# EAGLE design chariot_comms_a (EAGLE 9.3.0)
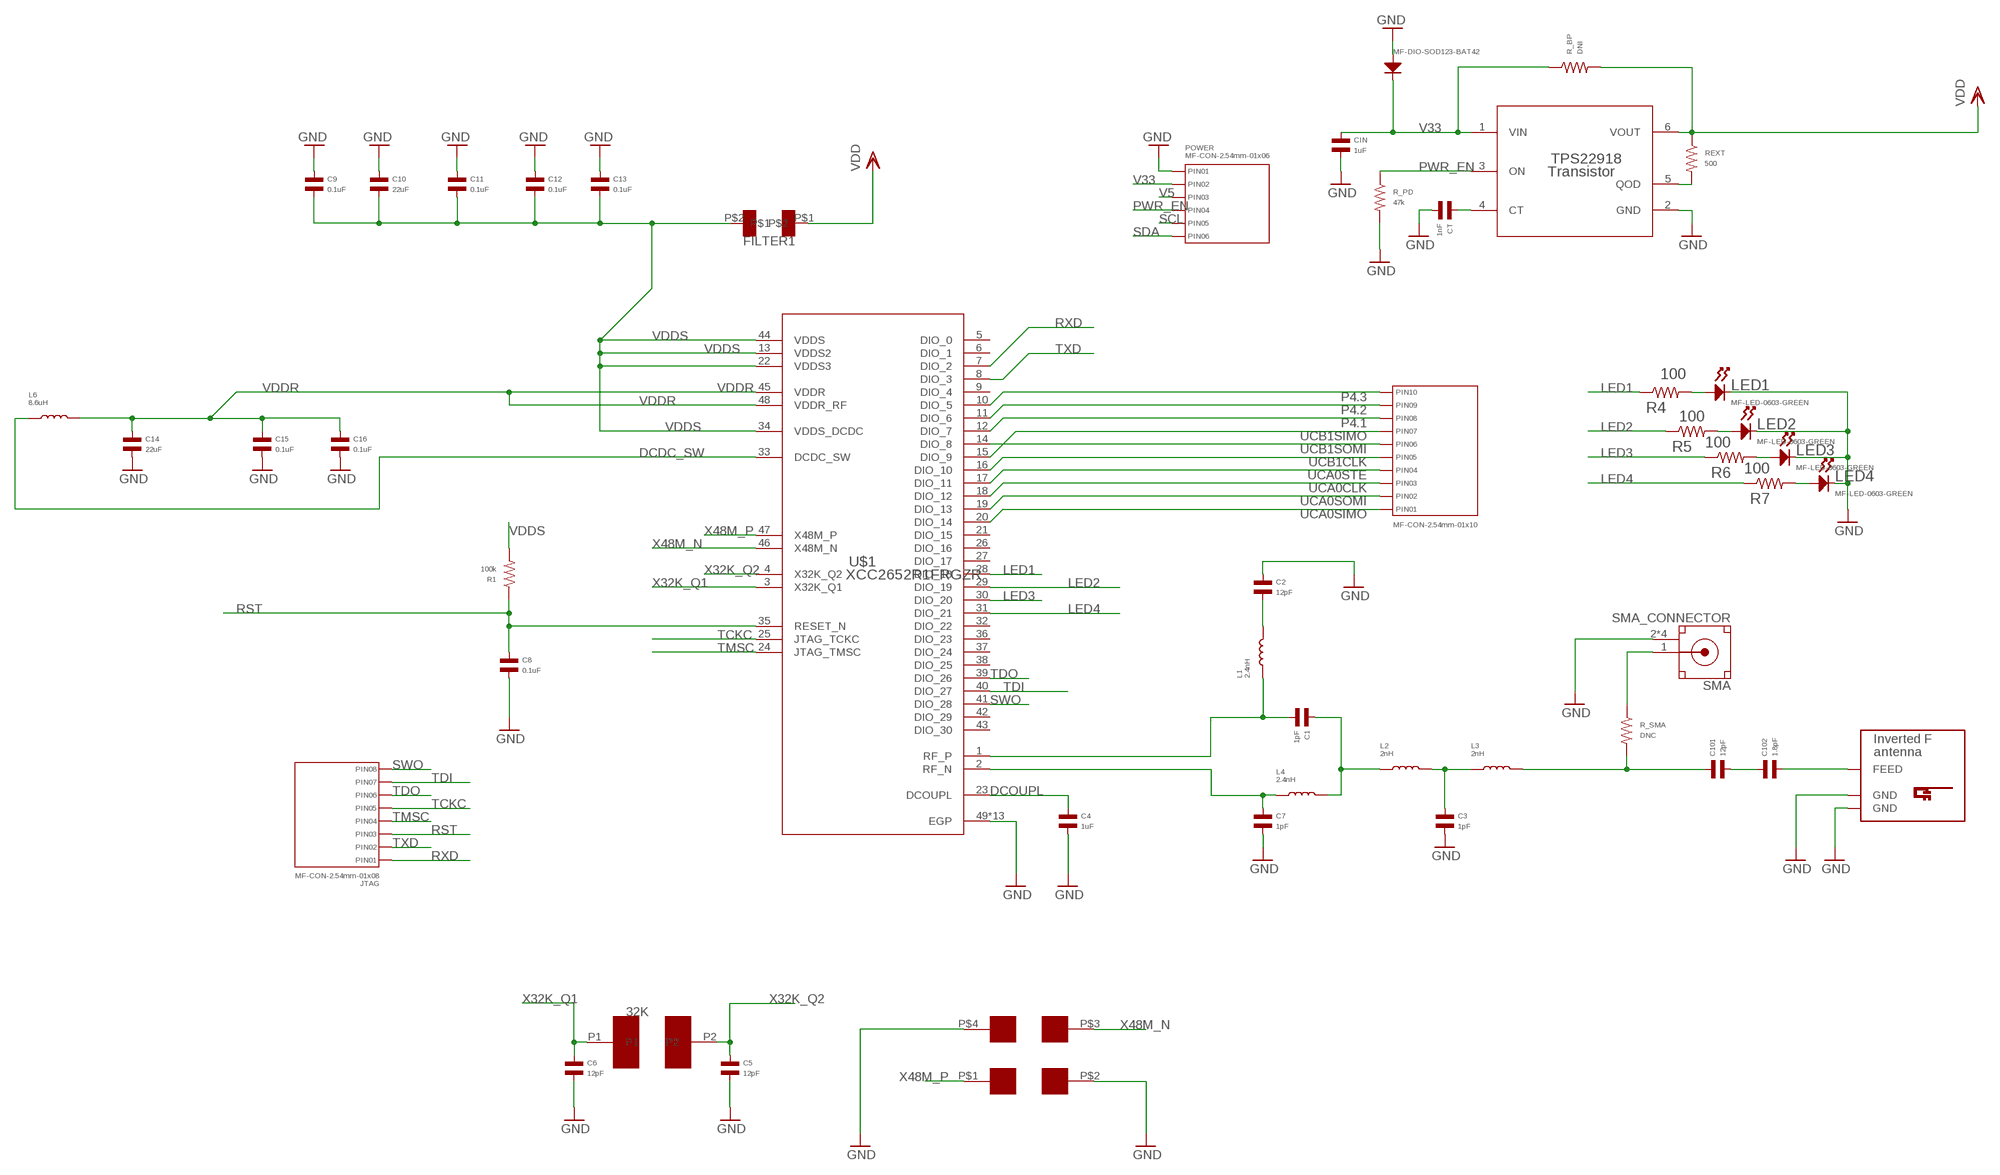
[diagram p0: schematic, sheet 1]

## Parts
32K  FC-135  [FC-135]
48M  NX2016SA-48M-EXS00A-CS05517  [NX2016SA-48M-EXS00A-CS05517]
C1  1pF  CAPACITOR_NP_0603  [C0603]
C2  12pF  CAPACITOR_NP_0603  [C0603]
C3  1pF  CAPACITOR_NP_0603  [C0603]
C4  1uF  CAPACITOR_NP_0603  [C0603]
C5  12pF  CAPACITOR_NP_0603  [C0603]
C6  12pF  CAPACITOR_NP_0603  [C0603]
C7  1pF  CAPACITOR_NP_0603  [C0603]
C8  0.1uF  CAPACITOR_NP_0603  [C0603]
C9  0.1uF  CAPACITOR_NP_0603  [C0603]
C10  22uF  CAPACITOR_NP_0603  [C0603]
C11  0.1uF  CAPACITOR_NP_0603  [C0603]
C12  0.1uF  CAPACITOR_NP_0603  [C0603]
C13  0.1uF  CAPACITOR_NP_0603  [C0603]
C14  22uF  CAPACITOR_NP_0603  [C0603]
C15  0.1uF  CAPACITOR_NP_0603  [C0603]
C16  0.1uF  CAPACITOR_NP_0603  [C0603]
C101  12pF  CAPACITOR_NP_0603  [C0603]
C102  1.8pF  CAPACITOR_NP_0603  [C0603]
CIN  1uF  CAPACITOR_NP_0603  [C0603]
COMMS_J  MF-CON-2.54mm-01x10  CON_01X10_PTH_2.54MM  [PTH_2.54MM_01X10]
CT  1nF  CAPACITOR_NP_0603  [C0603]
D1  MF-DIO-SOD123-BAT42  DIODES_BAT42_SOD-123  [SOD-123]
FILTER1  BLM18HE152SN1D  [BLM18HE152SN1D]
JTAG  MF-CON-2.54mm-01x08  CON_01X08_PTH_2.54MM  [PTH_2.54MM_01X08]
L1  2.4nH  INDUCTOR_0603  [L0603]
L2  2nH  INDUCTOR_0603  [L0603]
L3  2nH  INDUCTOR_0603  [L0603]
L4  2.4nH  INDUCTOR_0603  [L0603]
L6  8.6uH  INDUCTOR_0603  [L0603]
LED1  MF-LED-0603-GREEN  LED_SINGLE-0603-GREEN  [LED0603]
LED2  MF-LED-0603-GREEN  LED_SINGLE-0603-GREEN  [LED0603]
LED3  MF-LED-0603-GREEN  LED_SINGLE-0603-GREEN  [LED0603]
LED4  MF-LED-0603-GREEN  LED_SINGLE-0603-GREEN  [LED0603]
POWER  MF-CON-2.54mm-01x06  CON_01X06_PTH_2.54MM  [PTH_2.54MM_01X06]
R1  100k  RESISTOR_0603  [R0603]
R4  100  RESISTOR_0603  [R0603]
R5  100  RESISTOR_0603  [R0603]
R6  100  RESISTOR_0603  [R0603]
R7  100  RESISTOR_0603  [R0603]
R_BP  DNI  RESISTOR_0603  [R0603]
R_PD  47k  RESISTOR_0603  [R0603]
R_SMA  DNC  RESISTOR_0603  [R0603]
REXT  500  RESISTOR_0603  [R0603]
SMA  SMA_CONNECTOR  [LPRS_SMA_CONNECTOR]
TPS22918  Transistor  TPS22918TDBVRQ1  [DBV0006A_N]
U$1  XCC2652R1FRGZR  [RGZ0048A]
U$2  INVERTED_F_ANTENNA+5  [DN007+5]

## Nets
DCDC_SW: L6.P$1 U$1.33(DCDC_SW)
DCOUPL: C4.P$1 U$1.23(DCOUPL)
GND: 48M.P$2 48M.P$4 C2.P$1 C3.P$2 C4.P$2 C5.P$2 C6.P$2 C7.P$2 C8.P$2 C9.P$1 C10.P$1 C11.P$1 C12.P$1 C13.P$1 C14.P$2 C15.P$2 C16.P$2 CIN.P$2 CT.P$2 D1.ANODE LED1.CATHODE LED2.CATHODE LED3.CATHODE LED4.CATHODE POWER.P$1(PIN1) R_PD.P$2 SMA.2(GND) SMA.3(GND) SMA.4(GND) SMA.5(GND) TPS22918.2(GND) U$1.49(EGP) U$1.V1(EGP) U$1.V2(EGP) U$1.V3(EGP) U$1.V4(EGP) U$1.V5(EGP) U$1.V6(EGP) U$1.V7(EGP) U$1.V8(EGP) U$1.V9(EGP) U$1.V10(EGP) U$1.V11(EGP) U$1.V12(EGP) U$2.GND U$2.GND@1(GND)
LED1: R4.P$1 U$1.28(DIO_18)
LED2: R5.P$1 U$1.29(DIO_19)
LED3: R6.P$1 U$1.30(DIO_20)
LED4: R7.P$1 U$1.31(DIO_21)
N$1: C102.P$2 U$2.FEED
N$2: LED1.ANODE R4.P$2
N$3: C2.P$2 L1.P$2
N$4: C1.P$1 L2.P$1 L4.P$2
N$5: C3.P$1 L2.P$2 L3.P$1
N$6: C101.P$1 L3.P$2 R_SMA.P$2
N$7: C101.P$2 C102.P$1
N$8: LED2.ANODE R5.P$2
N$9: REXT.P$2 TPS22918.5(QOD)
N$10: CT.P$1 TPS22918.4(CT)
N$11: LED3.ANODE R6.P$2
N$12: LED4.ANODE R7.P$2
N$15: R_SMA.P$1 SMA.1(SIG)
P4.1: COMMS_J.P$8(PIN8) U$1.12(DIO_7)
P4.2: COMMS_J.P$9(PIN9) U$1.11(DIO_6)
P4.3: COMMS_J.P$10(PIN10) U$1.10(DIO_5)
PWR_EN: POWER.P$4(PIN4) R_PD.P$1 TPS22918.3(ON)
RF_N: C7.P$1 L4.P$1 U$1.2(RF_N)
RF_P: C1.P$2 L1.P$1 U$1.1(RF_P)
RST: C8.P$1 JTAG.P$3(PIN3) R1.P$1 U$1.35(RESET_N)
RXD: JTAG.P$1(PIN1) U$1.7(DIO_2)
SCL: POWER.P$5(PIN5)
SDA: POWER.P$6(PIN6)
SWO: JTAG.P$8(PIN8) U$1.41(DIO_28)
TCKC: JTAG.P$5(PIN5) U$1.25(JTAG_TCKC)
TDI: JTAG.P$7(PIN7) U$1.40(DIO_27)
TDO: JTAG.P$6(PIN6) U$1.39(DIO_26)
TMSC: JTAG.P$4(PIN4) U$1.24(JTAG_TMSC)
TXD: JTAG.P$2(PIN2) U$1.8(DIO_3)
UCA0CLK: COMMS_J.P$3(PIN3) U$1.18(DIO_12)
UCA0SIMO: COMMS_J.P$1(PIN1) U$1.20(DIO_14)
UCA0SOMI: COMMS_J.P$2(PIN2) U$1.19(DIO_13)
UCA0STE: COMMS_J.P$4(PIN4) U$1.17(DIO_11)
UCB1CLK: COMMS_J.P$5(PIN5) U$1.16(DIO_10)
UCB1SIMO: COMMS_J.P$7(PIN7) U$1.15(DIO_9)
UCB1SOMI: COMMS_J.P$6(PIN6) U$1.14(DIO_8)
V5: POWER.P$3(PIN3)
V33: CIN.P$1 D1.CATHODE POWER.P$2(PIN2) R_BP.P$1 TPS22918.1(VIN)
VDD: FILTER1.P$1 R_BP.P$2 REXT.P$1 TPS22918.6(VOUT)
VDDR: C14.P$1 C15.P$1 C16.P$1 L6.P$2 U$1.45(VDDR) U$1.48(VDDR_RF)
VDDS: C9.P$2 C10.P$2 C11.P$2 C12.P$2 C13.P$2 FILTER1.P$2 R1.P$2 U$1.13(VDDS2) U$1.22(VDDS3) U$1.34(VDDS_DCDC) U$1.44(VDDS)
X32K_Q1: 32K.P1 C6.P$1 U$1.3(X32K_Q1)
X32K_Q2: 32K.P2 C5.P$1 U$1.4(X32K_Q2)
X48M_N: 48M.P$3 U$1.46(X48M_N)
X48M_P: 48M.P$1 U$1.47(X48M_P)
Unconnected: U$1.5(DIO_0) U$1.6(DIO_1) U$1.9(DIO_4) U$1.21(DIO_15) U$1.26(DIO_16) U$1.27(DIO_17) U$1.32(DIO_22) U$1.36(DIO_23) U$1.37(DIO_24) U$1.38(DIO_25) U$1.42(DIO_29) U$1.43(DIO_30)

## Library data of the parts
32K = CharIoT:FC-135: 32 kHz Crystal Oscilator
48M = CharIoT:NX2016SA-48M-EXS00A-CS05517: 24 MHz Crystal Oscilator NX2016SA-48M-EXS00A-CS05517
C1-C16 C101 C102 CIN CT = MF_Passives:CAPACITOR_NP: Library: MF_Passives Description: Device for Non-Polarized Capacitors. Manufacture part number (MPN) can be added via Attributes. Check https://factory.macrofab.com/parts for the house parts list.; POPULATE: 1
COMMS_J = MF_Connectors:CON_01X10: Library: MF_Connectors Description: Header Connector with 10 Positions and 01 Rows. Use the LABEL Attribute to label the pin on the schematic and PCB. You can remove the attributes on the PCB by using the SMASH function on the part and then deleting the text.; HOUSEPART: YES; MPN: MF-CON-2.54mm-01x10; POPULATE: 1; URL: https://factory.macrofab.com/part/MF-CON-2.54mm-01x10
D1 = MF_Discrete_Semiconductor:DIODES: Library: MF_Discrete_Semiconductor Description: Device for Single Packaged Diodes.; HOUSEPART: YES; MPN: MF-DIO-SOD123-BAT42; POPULATE: 1; URL: https://factory.macrofab.com/part/MF-DIO-SOD123-BAT42
FILTER1 = CharIoT:BLM18HE152SN1D
JTAG = MF_Connectors:CON_01X08: Library: MF_Connectors Description: Header Connector with 8 Positions and 01 Rows. Use the LABEL Attribute to label the pin on the schematic and PCB. You can remove the attributes on the PCB by using the SMASH function on the part and then deleting the text.; HOUSEPART: YES; MPN: MF-CON-2.54mm-01x08; POPULATE: 1; URL: https://factory.macrofab.com/part/MF-CON-2.54mm-01x08
L1-L4 L6 = MF_Passives:INDUCTOR: Library: MF_Passives Description: Device for Inductors. Manufacture part number (MPN) can be added via Attributes. Check https://factory.macrofab.com/parts for the house parts list.; POPULATE: 1
LED1-LED4 = MF_LEDs:LED_SINGLE: Library: MF_LEDs Description: Device for Single LED Packages. Manufacture part number (MFG#) can be added via Attributes.; HOUSEPART: YES; MPN: MF-LED-0603-GREEN; POPULATE: 1; URL: https://factory.macrofab.com/part/MF-LED-0603-GREEN
POWER = MF_Connectors:CON_01X06: Library: MF_Connectors Description: Header Connector with 6 Positions and 01 Rows. Use the LABEL Attribute to label the pin on the schematic and PCB. You can remove the attributes on the PCB by using the SMASH function on the part and then deleting the text.; HOUSEPART: YES; MPN: MF-CON-2.54mm-01x06; POPULATE: 1; URL: https://factory.macrofab.com/part/MF-CON-2.54mm-01x06
R1 R4-R7 R_BP R_PD R_SMA REXT = MF_Passives:RESISTOR: Library: MF_Passives Description: Device for Resistors. Manufacture part number (MPN), Voltage, Tolerance, and Wattage Rating can be added via Attributes. Check https://factory.macrofab.com/parts for the house parts list.; POPULATE: 1
SMA = SMA_CONNECTOR:SMA_CONNECTOR: CONNECTOR, SMA, ANTENNA; SVHC: No SVHC (19-Dec-2012); For Use With: Antenna; Kit Contents: SMA Connecto; AVAILABILITY: Unavailable; DESCRIPTION: CONNECTOR, SMA, ANTENNA; SVHC: No SVHC _19-Dec-2012_; For Use With: Antenna; Kit Contents: SMA Connector; MF: LPRS; MP: SMA CONNECTOR; PACKAGE: None; PRICE: None
TPS22918 = CharIoT:TPS22918TDBVRQ1; MANUFACTURER: Texas Instruments; PARTNUMBER: TPS22918TDBVRQ1; REFDES: RefDes; TYPE: TYPE; VALUE: Value
U$1 = CharIoT:XCC2652R1FRGZR: Comms Chip
U$2 = antenna:INVERTED_F_ANTENNA: 2.4GHz Inverted F Antenna Based on TI Design Note DN007

## Board
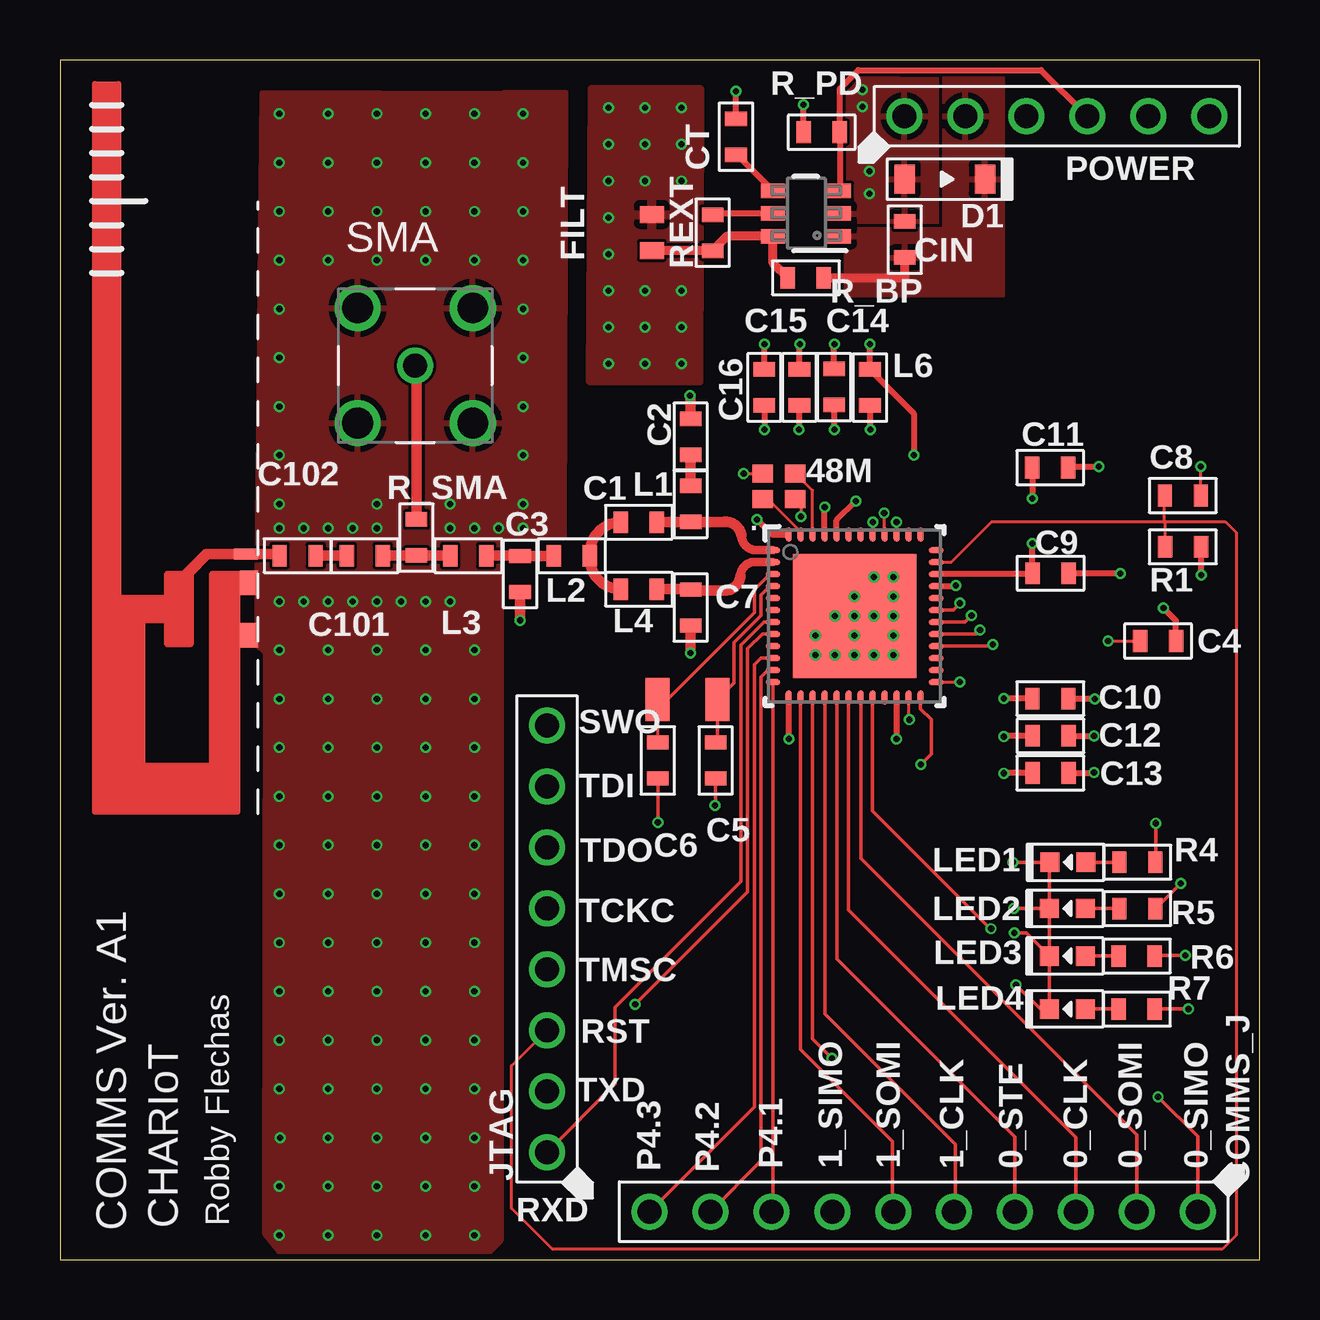
[diagram p1: board, top side]
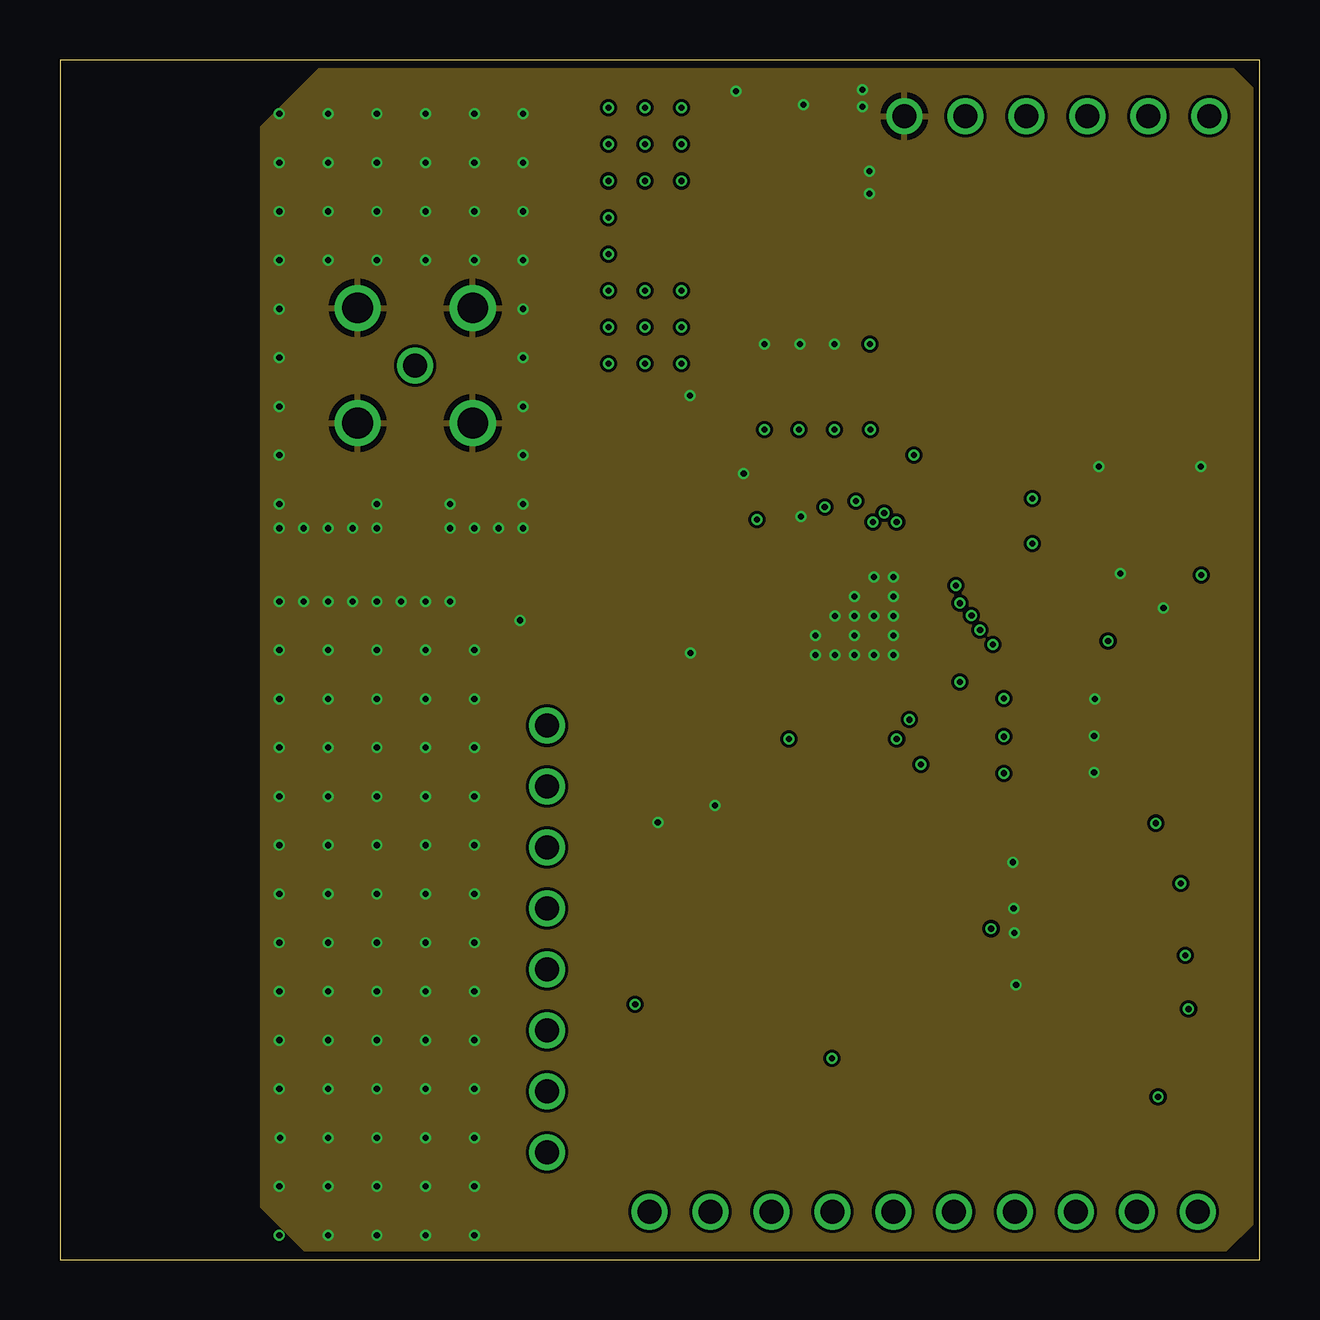
[diagram p2: board, inner layer Route2]
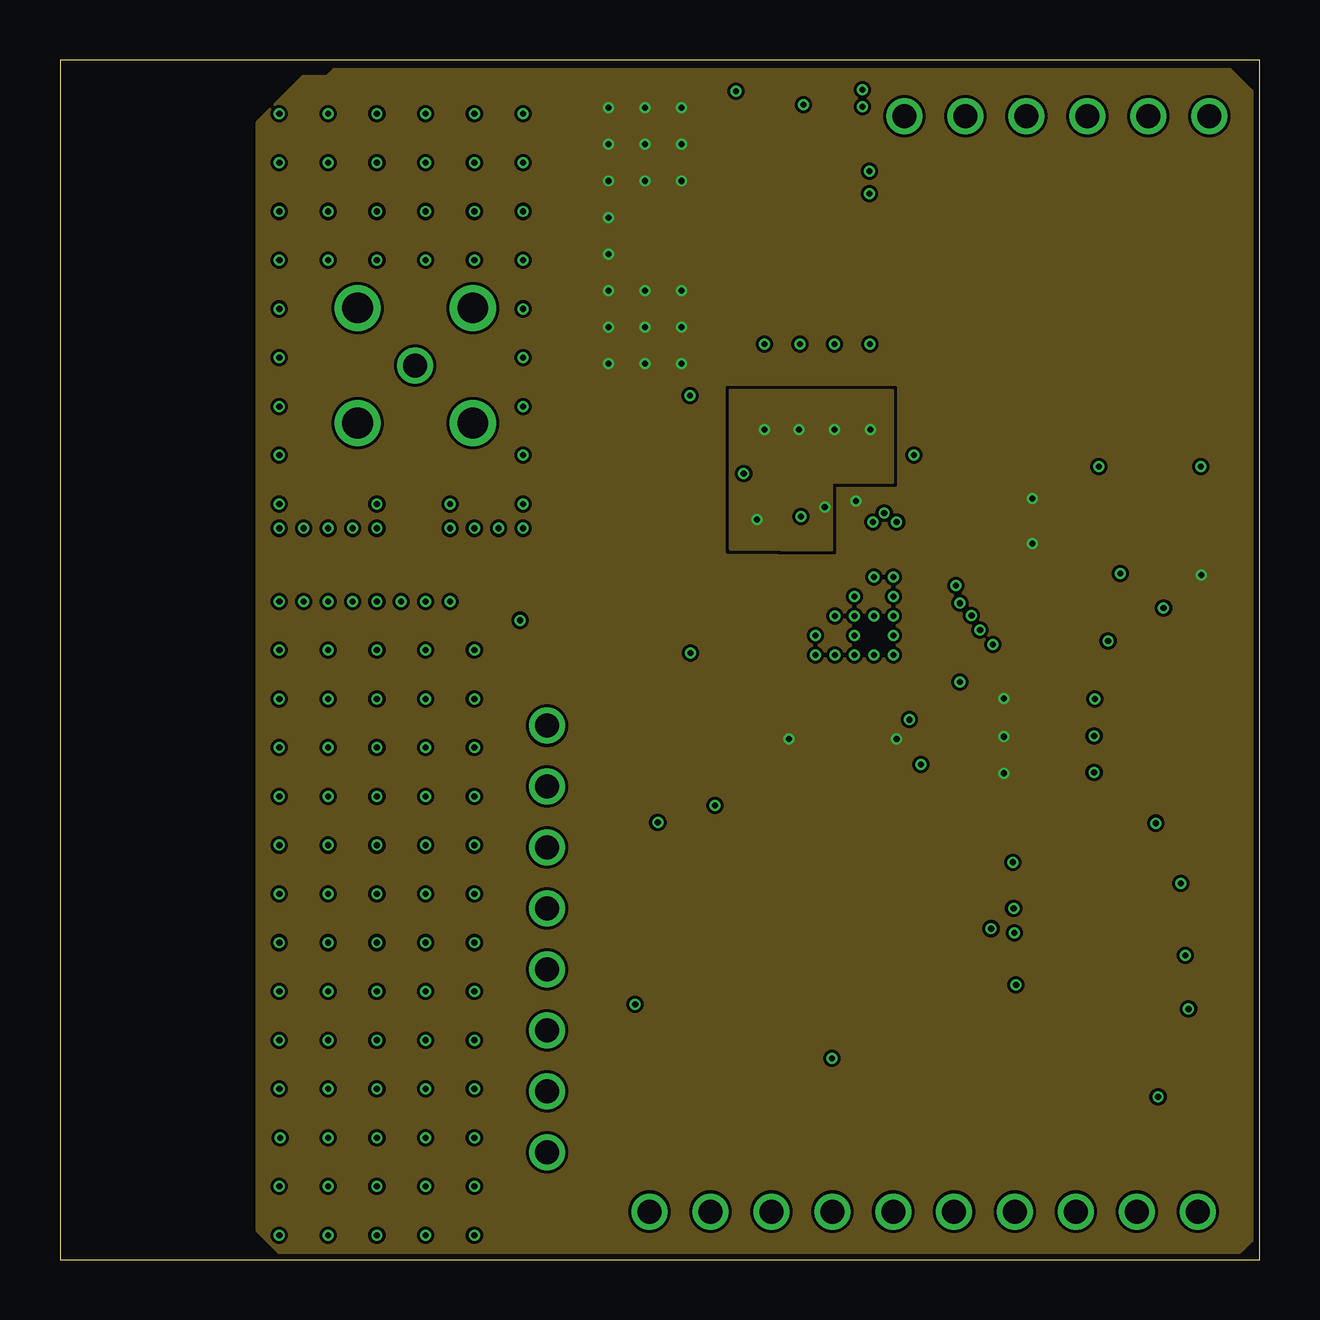
[diagram p3: board, inner layer Route15]
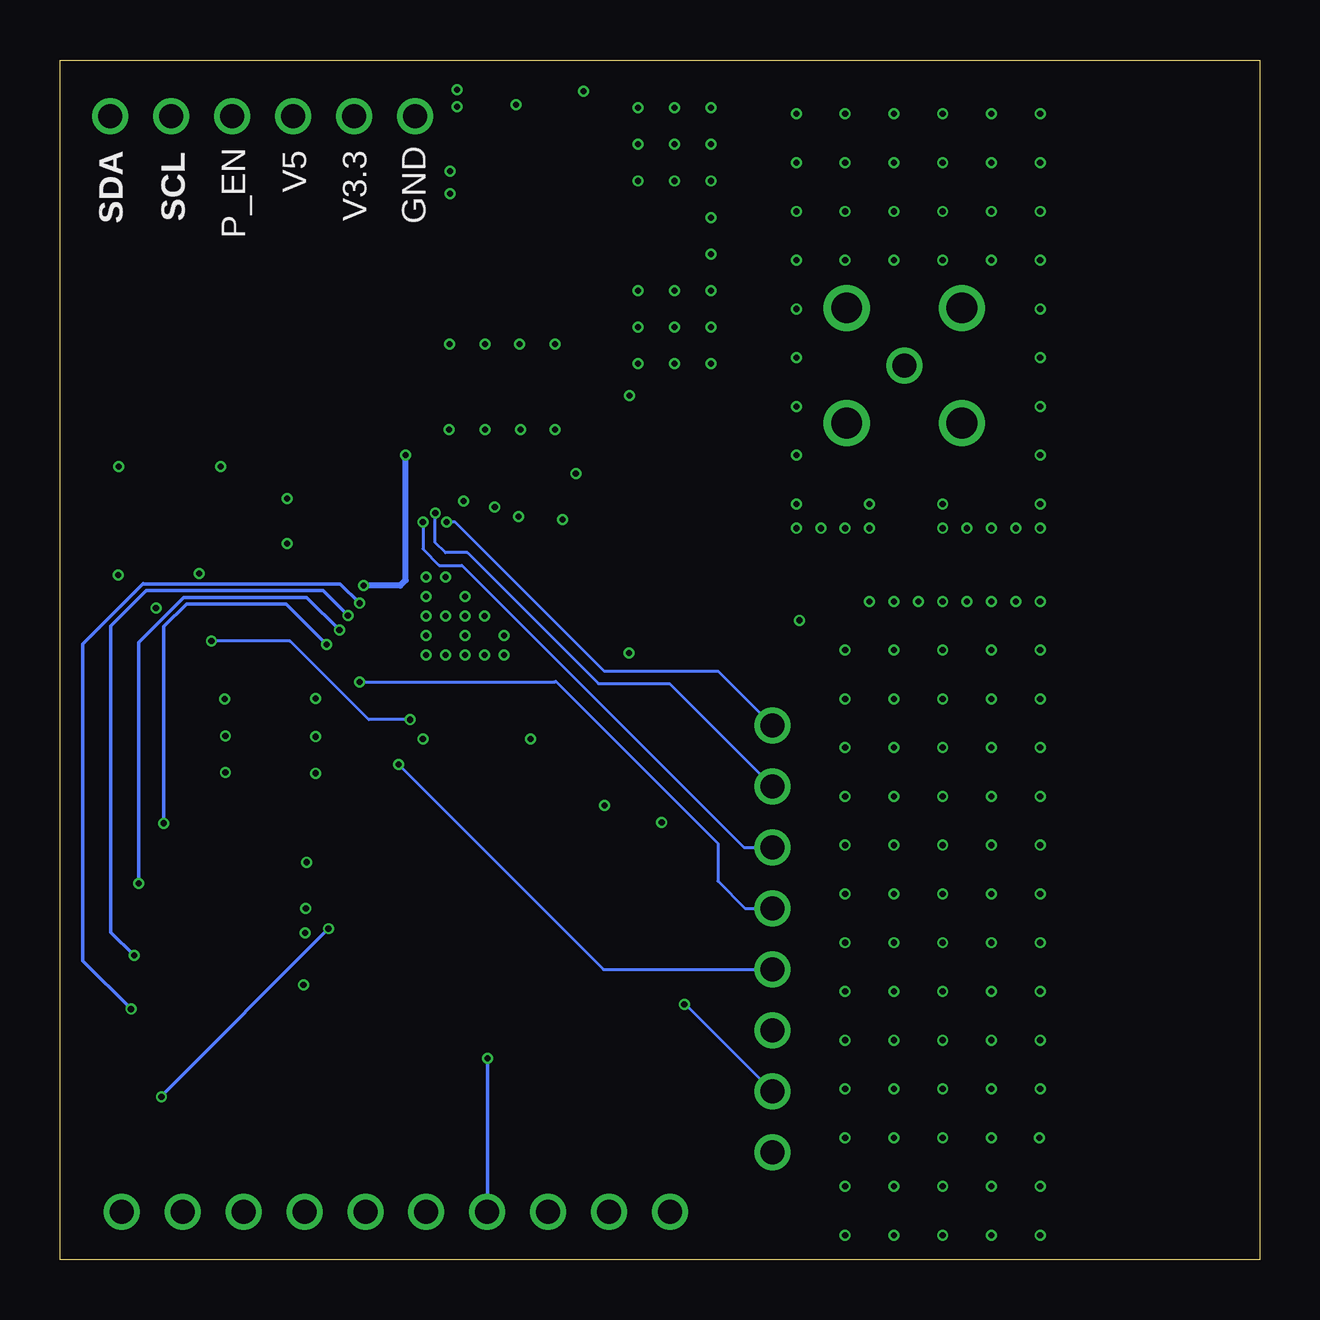
[diagram p4: board, bottom side, seen from below]

Size 50 x 50 mm. Coordinates in mm from the lower left corner, seen from the top.
Outline: 0,0 50,0 50,50 0,50 0,0
Copper layers (1*2*15*16): Top 0.035mm / dielectric 0.23mm / Route2 0.035mm / dielectric 0.93mm / Route15 0.035mm / dielectric 0.23mm / Bottom 0.035mm
Design rules "MF_Standard_4_Layer *": minimum track width 5mil, minimum drill 10mil, track to track 5mil, track to pad 5mil, pad to pad 5mil, via to via 5mil, smd to smd 0mil, copper to edge 10mil, drill to drill 10mil, minimum pad ring 4mil, minimum via ring 4mil, stop-mask expansion 2mil, vias tented up to drill 25mil, thermal gap 10mil

### Footprints (pad centres in the part's own frame; a part is rotated, then mirrored left to right if it is on the bottom)
FC-135 = smd 1 x 1.8: P1 -1.25,0; P2 1.25,0
NX2016SA-48M-EXS00A-CS05517 = smd 0.85 x 0.75: P$1 -0.675,-0.525; P$2 0.675,-0.525; P$3 0.675,0.525; P$4 -0.675,0.525
C0603 = smd 0.6 x 0.9: P$1 -0.75,0; P$2 0.75,0
PTH_2.54MM_01X10 = drill 1: P$1 -11.43,0; P$2 -8.89,0; P$3 -6.35,0; P$4 -3.81,0; P$5 -1.27,0; P$6 1.27,0; P$7 3.81,0; P$8 6.35,0; P$9 8.89,0; P$10 11.43,0
SOD-123 = smd 0.85 x 1.2: ANODE 1.675,0; CATHODE -1.675,0
BLM18HE152SN1D = smd 0.7 x 1: P$1 -0.75,0; P$2 0.75,0
PTH_2.54MM_01X08 = drill 1: P$1 -8.89,0; P$2 -6.35,0; P$3 -3.81,0; P$4 -1.27,0; P$5 1.27,0; P$6 3.81,0; P$7 6.35,0; P$8 8.89,0
L0603 = smd 0.6 x 0.9: P$1 -0.75,0; P$2 0.75,0
LED0603 = smd 0.8 x 0.8: ANODE 0.75,0; CATHODE -0.75,0
PTH_2.54MM_01X06 = drill 1: P$1 -6.35,0; P$2 -3.81,0; P$3 -1.27,0; P$4 1.27,0; P$5 3.81,0; P$6 6.35,0
R0603 = smd 0.6 x 0.9: P$1 -0.75,0; P$2 0.75,0
LPRS_SMA_CONNECTOR = drill 1: 1 0,0 | drill 1.28: 2 -2.4,2.4; 3 2.4,2.4; 4 -2.4,-2.4; 5 2.4,-2.4
DBV0006A_N = smd 1 x 0.6: 1 -1.375,0.95; 2 -1.375,0; 3 -1.375,-0.95; 4 1.375,-0.95; 5 1.375,0; 6 1.375,0.95
RGZ0048A = smd 0.6 x 0.24: 1 -3.4,2.75; 2 -3.4,2.25; 3 -3.4,1.75; 4 -3.4,1.25; 5 -3.4,0.75; 6 -3.4,0.25; 7 -3.4,-0.25; 8 -3.4,-0.75; 9 -3.4,-1.25; 10 -3.4,-1.75; 11 -3.4,-2.25; 12 -3.4,-2.75; 25 3.4,-2.75; 26 3.4,-2.25; 27 3.4,-1.75; 28 3.4,-1.25; 29 3.4,-0.75; 30 3.4,-0.25; 31 3.4,0.25; 32 3.4,0.75; 33 3.4,1.25; 34 3.4,1.75; 35 3.4,2.25; 36 3.4,2.75 | smd 0.24 x 0.6: 13 -2.75,-3.4; 14 -2.25,-3.4; 15 -1.75,-3.4; 16 -1.25,-3.4; 17 -0.75,-3.4; 18 -0.25,-3.4; 19 0.25,-3.4; 20 0.75,-3.4; 21 1.25,-3.4; 22 1.75,-3.4; 23 2.25,-3.4; 24 2.75,-3.4; 37 2.75,3.4; 38 2.25,3.4; 39 1.75,3.4; 40 1.25,3.4; 41 0.75,3.4; 42 0.25,3.4; 43 -0.25,3.4; 44 -0.75,3.4; 45 -1.25,3.4; 46 -1.75,3.4; 47 -2.25,3.4; 48 -2.75,3.4 | smd 5.15 x 5.15: 49 0,0 | smd 0.5 x 0.5: V1 -0.803,2.325; V2 0.803,2.325; V3 -2.325,0.803; V4 -0.803,0.803; V5 0.803,0.803; V6 2.325,0.803; V7 -2.325,-0.803; V8 -0.803,-0.803; V9 0.803,-0.803; V10 2.325,-0.803; V11 -0.803,-2.325; V12 0.803,-2.325
DN007+5 = smd 0.46 x 1: FEED 2.22,-2.8 | smd 1.01 x 0.74: GND -1.16,-2.93; GND@1 1.035,-2.93

### Placement (x,y rotation side)
32K  26.16,23.34 0 top
48M  29.97,32.23 0 top
C1  24.13,30.73 0 top
C2  26.29,34.29 270 top
C3  19.18,28.57 270 top
C4  45.77,25.78 0 top
C5  27.33,20.8 270 top
C6  24.92,20.8 270 top
C7  26.29,27.18 270 top
C8  46.8,31.85 0 top
C9  41.29,28.61 180 top
C10  41.28,23.38 180 top
C11  41.28,33.01 180 top
C12  41.29,21.83 180 top
C13  41.28,20.28 180 top
C14  32.26,36.37 90 top
C15  30.82,36.35 90 top
C16  29.36,36.36 90 top
C101  12.7,29.34 180 top
C102  9.91,29.34 180 top
CIN  35.21,42.51 90 top
COMMS_J  36,2 180 top
CT  28.18,46.8 90 top
D1  36.88,45.03 180 top
FILTER1  24.68,42.81 90 top
JTAG  20.29,13.36 90 top
L1  26.29,31.5 90 top
L2  21.34,29.34 180 top
L3  17.02,29.34 180 top
L4  24.13,27.94 180 top
L6  33.76,36.35 270 top
LED1  42.01,16.56 0 top
LED2  41.99,14.63 0 top
LED3  41.99,12.65 0 top
LED4  41.99,10.44 0 top
POWER  41.55,47.65 0 top
R1  46.81,29.7 0 top
R4  44.91,16.56 180 top
R5  44.91,14.63 180 top
R6  44.88,12.65 180 top
R7  44.88,10.44 180 top
R_BP  31.09,40.92 180 top
R_PD  31.75,46.99 180 top
R_SMA  14.86,30.1 270 top
REXT  27.2,42.8 90 top
SMA  14.81,37.26 0 top
TPS22918  31.1,43.6 180 top
U$1  33.12,26.82 0 top
U$2  4.95,27.18 90 top

### Tracks (layer width: path | path; a pad name or v marks a point on that pad's centre or on a via)
DCDC_SW  (via drill 0.25)
  Top 0.254: v33.76,38.15 L6.P$1 35.59,35.27 v35.59,33.53 | U$1.33 37.32,28.07 v37.34,28.09
  Bottom 0.254: v35.59,33.53 35.59,28.32 35.82,28.09 v37.34,28.09
DCOUPL  (via drill 0.25)
  Top 0.127: U$1.23 35.37,22.53 v35.4,22.5 | v43.69,25.78 C4.P$1
  Bottom 0.127: v35.4,22.5 37.13,22.5 39.08,24.45 | 39.08,24.45 | 39.08,24.45 40.41,25.78 v43.69,25.78
GND  (via drill 0.25)
  Top 0.127: C8.P$2 v47.55,33.04 v47.55,33.05 | 48M.P$2 30.89,31.47 v30.89,30.96 | v28.5,32.77 28.51,32.76 48M.P$4
  Top 0.152: LED3.CATHODE LED4.CATHODE 40.87,10.44 v39.85,11.46 | LED3.CATHODE LED2.CATHODE | LED2.CATHODE 41.24,16.54 LED1.CATHODE v39.73,16.56 | LED3.CATHODE 40.27,13.61 v39.78,13.61 | LED2.CATHODE v39.75,14.63 | C6.P$2 v24.92,18.21 | C5.P$2 27.33,18.95 v27.3,18.92 | U$1.V2 33.93,29.14 v33.93,28.45 | U$1.V6 35.44,27.64 v34.75,27.64 | U$1.V1 U$1.V4 U$1.49 | 33.12,25.3 U$1.V11 | U$1.49 33.12,25.3 | 33.12,25.3 U$1.V12 | U$1.49 U$1.V8 | U$1.49 U$1.V9 | 31.6,26.82 U$1.V7 | U$1.49 34.64,26.82 U$1.V10 | U$1.49 U$1.V5 | U$1.49 31.6,26.82 | 31.6,26.82 U$1.V3
  Top 0.254: 26.29,35.99 v26.26,36.02 | CT.P$2 v28.18,48.7 | R_PD.P$2 arc-90 30.99,47 v30.99,48.13 | C10.P$1 43.12,23.38 v43.13,23.37 | C12.P$1 v43.1,21.83 v43.1,21.82 | C13.P$1 43.09,20.28 v43.1,20.3 | C11.P$1 42.06,33.05 v43.31,33.05 | C9.P$1 44.18,28.61 v44.2,28.59 | C4.P$2 46.52,26.63 v46,27.15 | C16.P$2 v29.36,38.15 | C15.P$2 30.82,38.14 v30.84,38.15 | C14.P$2 32.26,38.13 v32.28,38.15
  Top 0.434: C3.P$2 v19.18,26.64 | C2.P$1 26.29,35.99 | C7.P$2 v26.29,25.27
  other vias: 17.27,23.37 17.27,21.34 17.27,19.3 17.27,17.27 17.27,15.24 17.27,13.21 17.27,11.18 17.27,9.14 17.27,7.11 17.27,5.08 17.27,3.05 17.27,1.02 15.24,1.02 13.21,1.02 11.18,1.02 9.14,1.02 9.14,3.05 9.17,5.08 9.14,7.11 9.14,9.14 9.14,11.18 9.14,13.21 9.14,15.24 9.14,17.27 9.14,19.3 9.14,21.34 9.14,23.37 9.14,25.4 17.27,25.4 16.26,27.43 15.24,27.43 14.22,27.43 13.21,27.43 12.19,27.43 11.18,27.43 11.18,23.37 13.21,23.37 15.24,23.37 11.18,21.34 13.21,21.34 15.24,21.34 15.24,19.3 13.21,19.3 11.18,19.3 11.18,17.27 13.21,17.27 15.24,17.27 15.24,15.24 13.21,15.24 11.18,15.24 11.18,13.21 13.21,13.21 15.24,13.21 15.24,11.18 13.21,11.18 11.18,11.18 11.18,9.14 13.21,9.14 15.24,9.14 15.24,7.11 13.21,7.11 11.18,7.11 11.18,5.08 13.21,5.08 15.24,5.08 15.24,3.05 13.21,3.05 11.18,3.05 15.24,25.4 13.21,25.4 11.18,25.4 33.45,48.77 33.45,48.06 33.73,45.36 33.73,44.42 13.21,31.5 19.3,30.48 18.29,30.48 17.27,30.48 16.26,30.48 19.3,31.5 19.3,33.53 19.3,35.56 19.3,37.59 19.3,39.62 19.3,41.66 19.3,43.69 19.3,45.72 19.3,47.75 11.18,47.75 9.14,47.75 9.14,45.72 9.14,43.69 9.14,41.66 9.14,39.62 9.14,37.59 9.14,35.56 9.14,33.53 9.14,31.5 11.18,30.48 12.19,30.48 13.21,30.48 10.16,30.48 17.27,47.75 16.26,31.5 17.27,45.72 17.27,43.69 17.27,41.66 15.24,43.69 15.24,45.72 13.21,45.72 11.18,45.72 11.18,43.69 13.21,43.69 10.16,27.43 9.14,27.43 9.14,30.48 13.21,47.75 15.24,47.75 15.24,41.66 13.21,41.66 11.18,41.66 33.12,26.82 32.31,26.82 33.93,26.82 33.12,26.01 33.12,27.64 34.75,26.82 34.75,28.45 34.75,26.01 34.75,25.2 33.12,25.2 33.93,25.2 32.31,25.2 31.5,25.2 31.5,26.01
  pour Route2: 10.8,49.6 8.4,47.2 8.4,47.1 8.4,2.2 10.2,0.4 48.6,0.4 49.7,1.5 49.7,48.8 48.9,49.6
  pour Top: 8.23,28.65 8.46,48.64 18.39,48.59 18.36,28.04 18.36,0.79 17.88,0.3 9.17,0.3 8.56,1.07 8.59,25.27 8.36,25.5 8.33,25.5 8.23,25.6
  pour Top: 36.6,49.23 33.38,49.25 32.74,48.59 32.74,43.23 36.6,43.23
  pour Top: 18.44,30.1 21.01,30.1 21.08,48.62 18.49,48.62 18.49,32.18 18.41,32.18
LED1  (via drill 0.25)
  Top 0.152: U$1.28 38.83,25.57 v38.89,25.63 | v45.67,18.19 45.67,16.57 R4.P$1
  Bottom 0.152: v38.89,25.63 40.58,27.32 44.72,27.32 45.67,26.38 v45.67,18.19
LED2  (via drill 0.25)
  Top 0.152: U$1.29 38.19,26.07 v38.35,26.24 | v46.71,15.67 R5.P$1
  Bottom 0.152: v38.35,26.24 39.71,27.6 44.84,27.6 46.71,25.73 v46.71,15.67
LED3  (via drill 0.25)
  Top 0.152: U$1.30 37.72,26.57 v38,26.85 | v46.91,12.68 45.66,12.68 R6.P$1
  Bottom 0.152: v38,26.85 39.03,27.88 46.42,27.88 47.88,26.42 47.88,13.64 v46.91,12.68
LED4  (via drill 0.25)
  Top 0.152: U$1.31 37.23,27.07 v37.52,27.36 | v47.04,10.44 R7.P$1
  Bottom 0.152: v37.52,27.36 38.32,28.16 46.52,28.16 46.53,28.17 49.05,25.65 49.05,12.45 v47.04,10.44
N$1
  Top 0.254: 9.1,29.4 C102.P$2
  Top 0.434: U$2.FEED 9.1,29.4
N$2
  Top 0.152: LED1.ANODE R4.P$2
N$3
  Top 0.127: 26.29,33.45 C2.P$2
  Top 0.434: L1.P$2 26.29,33.45
N$4
  Top 0.434: C1.P$1 arc90 22.09,29.44 L2.P$1 22.09,29.23 arc90 L4.P$2
N$5
  Top 0.254: 20.57,29.32 L2.P$2
  Top 0.434: L3.P$1 19.16,29.34 C3.P$1 20.57,29.32
N$6
  Top 0.254: 16.26,29.35 L3.P$2
  Top 0.434: C101.P$1 14.85,29.34 R_SMA.P$2 16.26,29.35
N$7
  Top 0.434: C102.P$1 C101.P$2
N$8
  Top 0.152: LED2.ANODE R5.P$2
N$9
  Top 0.254: TPS22918.5 27.25,43.6 REXT.P$2
N$10
  Top 0.254: TPS22918.4 28.23,46.05 CT.P$1
N$11
  Top 0.152: LED3.ANODE R6.P$2
N$12
  Top 0.152: LED4.ANODE R7.P$2
N$15
  Top 0.434: R_SMA.P$1 14.86,37.26 SMA.1
P4.1
  Top 0.127: U$1.12 29.72,23.95
  Top 0.152: 29.72,23.95 29.72,2.07 COMMS_J.P$8
P4.2
  Top 0.152: U$1.11 29.5,24.57 29.22,24.29 29.22,4.11 COMMS_J.P$9
P4.3
  Top 0.152: U$1.10 29.21,25.07 28.94,24.8 28.94,6.37 COMMS_J.P$10
PWR_EN
  Top 0.152: 32.5,44.58 TPS22918.3
  Top 0.254: 32.5,44.58 R_PD.P$1 32.5,48.8 33.28,49.58 40.89,49.58 POWER.P$4
RF_N
  Top 0.356: U$1.2 28.95,29.07 arc90 28.37,28.5
  Top 0.434: L4.P$1 26.28,27.94 C7.P$1 arc90 26.33,27.89 27.66,27.89 arc90 28.37,28.5
RF_P
  Top 0.356: U$1.1 29.02,29.57 arc-90 28.4,30.2
  Top 0.434: C1.P$2 26.28,30.73 arc90 L1.P$1 27.65,30.75 arc-90 28.4,30.2
RST
  Top 0.127: 46.02,30.76 48.56,30.76 49.02,30.3 49.02,1.02 48.44,0.43 20.52,0.43 18.82,2.13 18.82,8.08 JTAG.P$3 | 46.02,30.76 46.02,31.82 C8.P$1 | 46.02,30.76 46.06,30.73 R1.P$1 | U$1.35 37.15,29.07 38.84,30.76 46.02,30.76
RXD
  Top 0.152: JTAG.P$1 23.14,7.32 23.14,10.52 28.38,15.76 28.38,25.61 29.34,26.57 U$1.7
SWO  (via drill 0.25)
  Top 0.127: U$1.41 33.88,30.23 v33.88,30.73
  Bottom 0.127: JTAG.P$8 22.55,24.51 27.3,24.51 33.53,30.73 v33.88,30.73
TCKC  (via drill 0.25)
  Top 0.127: U$1.25 v37.51,24.07 v37.52,24.08
  Bottom 0.127: v37.52,24.08 29.36,24.08 29.34,24.11 22.58,17.35 22.58,15.77 21.44,14.63 JTAG.P$5
TDI  (via drill 0.25)
  Top 0.127: U$1.40 34.37,31.1 v34.35,31.11
  Bottom 0.127: JTAG.P$7 24.59,24 27.56,24 33.02,29.46 33.94,29.46 34.35,29.88 v34.35,31.11
TDO  (via drill 0.25)
  Top 0.127: U$1.39 v34.87,30.73
  Bottom 0.127: v34.87,30.73 34.87,29.62 34.19,28.93 33.25,28.93 21.49,17.17 JTAG.P$6
TMSC  (via drill 0.25)
  Top 0.152: U$1.24 35.87,22.95 36.32,22.5 36.32,21.06 v35.89,20.63
  Bottom 0.127: v35.89,20.63 27.35,12.09 JTAG.P$4
TXD  (via drill 0.25)
  Top 0.152: U$1.8 29.27,26.07 28.66,25.46 28.66,15.32 v23.98,10.64
  Bottom 0.127: JTAG.P$2 23.93,10.64 v23.98,10.64
UCA0CLK
  Top 0.152: COMMS_J.P$3 42.35,5.1 32.87,14.58 U$1.18
UCA0SIMO  (via drill 0.25)
  Top 0.127: 33.87,23.37 U$1.20
  Top 0.152: COMMS_J.P$1 47.42,5.13 v45.77,6.78 | 33.87,23.37 33.86,23.35 33.86,18.69 38.76,13.79 v38.81,13.79
  Bottom 0.152: v38.81,13.79 45.77,6.83 v45.77,6.78
UCA0SOMI
  Top 0.152: COMMS_J.P$2 44.89,5.03 44.89,5.2 33.38,16.71 U$1.19
UCA0STE
  Top 0.127: 32.37,23.32 U$1.17
  Top 0.152: COMMS_J.P$4 39.8,5.03 39.8,5.11 32.38,12.52 32.38,23.3 32.37,23.32
UCB1CLK
  Top 0.127: 31.87,23.39 U$1.16
  Top 0.152: COMMS_J.P$5 37.31,2.04 37.31,4.8 31.88,10.24 31.88,21.36 | 31.88,21.36 31.88,23.39 31.87,23.39 | 31.88,21.36
UCB1SIMO  (via drill 0.25)
  Top 0.152: v32.18,8.38 31.37,9.2 U$1.15
  Bottom 0.152: v32.18,8.38 COMMS_J.P$7
UCB1SOMI
  Top 0.127: 30.87,23.39 U$1.14
  Top 0.152: COMMS_J.P$6 34.7,2.03 34.7,4.93 30.86,8.76 30.86,23.38 30.87,23.39
V33
  Top 0.381: R_BP.P$1 35.21,40.92 CIN.P$1
  pour Top (rank 3): 39.34,49.25 33.4,49.25 32.74,48.59 32.72,48.59 32.72,40.18 35.53,40.18 39.34,40.18 39.34,49.23
VDD
  Top 0.381: R_BP.P$2 29.73,41.53 TPS22918.6 27.8,42.65 REXT.P$1 FILTER1.P$1
VDDR  (via drill 0.25)
  Top 0.254: C16.P$1 v29.36,34.6 v29.36,34.59 | C15.P$1 v30.81,34.59 | C14.P$1 32.26,34.61 v32.28,34.59 | L6.P$2 33.76,34.62 v33.78,34.59 | v29.06,30.84 29.67,30.22 U$1.48 | U$1.45 v31.87,31.36 v31.88,31.37
  pour Route15: 27.94,36.25 27.94,29.62 32.16,29.57 32.16,32.41 34.7,32.41 34.7,36.22
VDDS  (via drill 0.25)
  Top 0.254: U$1.34 40.5,28.57 C9.P$2 v40.54,29.84 | U$1.44 32.37,30.82 v33.17,31.62 | C12.P$2 39.38,21.83 v39.34,21.79 | C13.P$2 39.36,20.28 v39.34,20.27 | U$1.22 v34.87,21.69 | U$1.13 30.37,21.7 v30.38,21.69 | C11.P$2 40.52,31.74 v40.54,31.73 | R1.P$2 47.56,28.54 v47.57,28.52 | C10.P$2 arc90 40.52,23.39 v39.34,23.39
  Top 0.381: FILTER1.P$2 24.66,43.56
  other vias: 24.38,44.96 25.91,38.86 24.38,38.86 24.38,37.34 25.91,37.34 25.91,40.39 24.38,40.39 22.86,40.39 22.86,38.86 22.86,37.34 22.86,41.91 22.86,43.43 22.86,44.96 22.86,46.48 24.38,46.48 25.91,46.48 25.91,48.01 24.38,48.01 22.86,48.01 25.91,44.96
  pour Route15 (rank 6): 11.1,49.3 10.1,49.3 8.2,47.4 8.2,43 8.2,1.2 9.2,0.2 49.1,0.2 49.7,0.8 49.7,48.7 48.8,49.6 11.4,49.6
  pour Top: 26.67,48.77 22.17,48.77 22.1,36.63 26.64,36.63 26.67,48.18
X32K_Q1
  Top 0.127: 32K.P1 C6.P$1
  Top 0.152: 32K.P1 25.32,23.34 28.94,26.96 28.94,27.93 29.59,28.57 U$1.3
X32K_Q2
  Top 0.152: C5.P$1 27.41,21.63 32K.P2 28.1,24.03 28.1,25.73 29.22,26.84 29.22,27.71 29.59,28.07 U$1.4
X48M_N
  Top 0.127: U$1.46 31.37,32.05 30.67,32.76 48M.P$3
X48M_P
  Top 0.127: 48M.P$1 29.51,31.71 30.87,30.34 U$1.47

### Text on the board
tNames: FILT | 48M | SWO | TDI | TDO | TCKC | TMSC | RST | TXD | P4.3 | P4.2 | P4.1 | 1_SIMO | 1_SOMI | 1_CLK | 0_STE | 0_CLK | 0_SOMI | 0_SIMO | RXD | COMMS Ver. A1 | CHARIoT | Robby Flechas
bNames: V3.3 | V5 | P_EN | SCL | SDA | GND